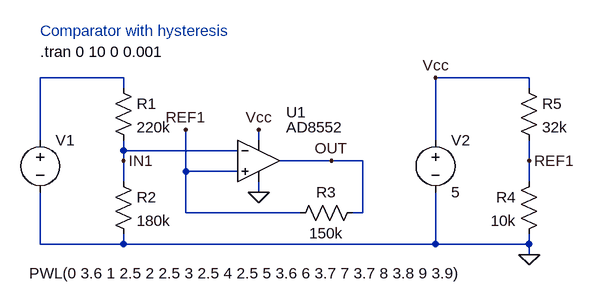
[diagram p0: schematic Comparator_with_hysteresis.asc]
Comparator_with_hysteresis.asc, the LTspice schematic file:
Version 4
SHEET 1 948 680
WIRE 256 176 128 176
WIRE 880 176 736 176
WIRE 256 192 256 176
WIRE 880 192 880 176
WIRE 128 272 128 176
WIRE 464 272 464 256
WIRE 736 272 736 176
WIRE 256 288 256 272
WIRE 432 288 256 288
WIRE 256 304 256 288
WIRE 576 304 496 304
WIRE 624 304 576 304
WIRE 880 304 880 272
WIRE 352 320 352 256
WIRE 432 320 352 320
WIRE 256 336 256 304
WIRE 880 336 880 304
WIRE 464 352 464 336
WIRE 352 384 352 320
WIRE 528 384 352 384
WIRE 624 384 624 304
WIRE 624 384 608 384
WIRE 128 432 128 352
WIRE 256 432 256 416
WIRE 256 432 128 432
WIRE 736 432 736 352
WIRE 736 432 256 432
WIRE 880 432 880 416
WIRE 880 432 736 432
WIRE 880 448 880 432
FLAG 736 176 Vcc
FLAG 880 304 REF1
FLAG 464 256 Vcc
FLAG 464 352 0
FLAG 880 448 0
FLAG 352 256 REF1
FLAG 576 304 OUT
FLAG 256 304 IN1
SYMBOL OpAmps\\AD8552 464 240 R0
WINDOW 0 42 -11 Left 2
WINDOW 3 42 12 Left 2
SYMATTR InstName U1
SYMBOL voltage 128 256 R0
WINDOW 3 -17 221 Left 2
WINDOW 123 0 0 Left 0
WINDOW 39 0 0 Left 0
SYMATTR Value PWL(0 3.6 1 2.5 2 2.5 3 2.5 4 2.5 5 3.6 6 3.7 7 3.7 8 3.8 9 3.9)
SYMATTR InstName V1
SYMBOL res 240 176 R0
SYMATTR InstName R1
SYMATTR Value 220k
SYMBOL res 240 320 R0
SYMATTR InstName R2
SYMATTR Value 180k
SYMBOL res 624 368 R90
WINDOW 0 0 56 VBottom 2
WINDOW 3 32 56 VTop 2
SYMATTR InstName R3
SYMATTR Value 150k
SYMBOL voltage 736 256 R0
WINDOW 123 0 0 Left 0
WINDOW 39 0 0 Left 0
SYMATTR InstName V2
SYMATTR Value 5
SYMBOL res 896 320 M0
SYMATTR InstName R4
SYMATTR Value 10k
SYMBOL res 864 176 R0
SYMATTR InstName R5
SYMATTR Value 32k
TEXT 128 104 Left 2 ;Comparator with hysteresis
TEXT 128 136 Left 2 !.tran 0 10 0 0.001

The netlist it stands for:
* Comparator_with_hysteresis.asc
XU1 REF1 IN1 Vcc 0 OUT AD8552  ; pins In+ In- V+ V- OUT
V1 N001 0 PWL(0 3.6 1 2.5 2 2.5 3 2.5 4 2.5 5 3.6 6 3.7 7 3.7 8 3.8 9 3.9)
R1 N001 IN1 220k
R2 IN1 0 180k
R3 OUT REF1 150k
V2 Vcc 0 5
R4 REF1 0 10k
R5 Vcc REF1 32k
* Comparator with hysteresis
.tran 0 10 0 0.001
.backanno
.end